# EAGLE design Adafruit Feather M0 Basic rev C (EAGLE 8.4.1)
COMPANY: ADAFRUIT INDUSTRIES; DRAWN: KTOWN; REV: B
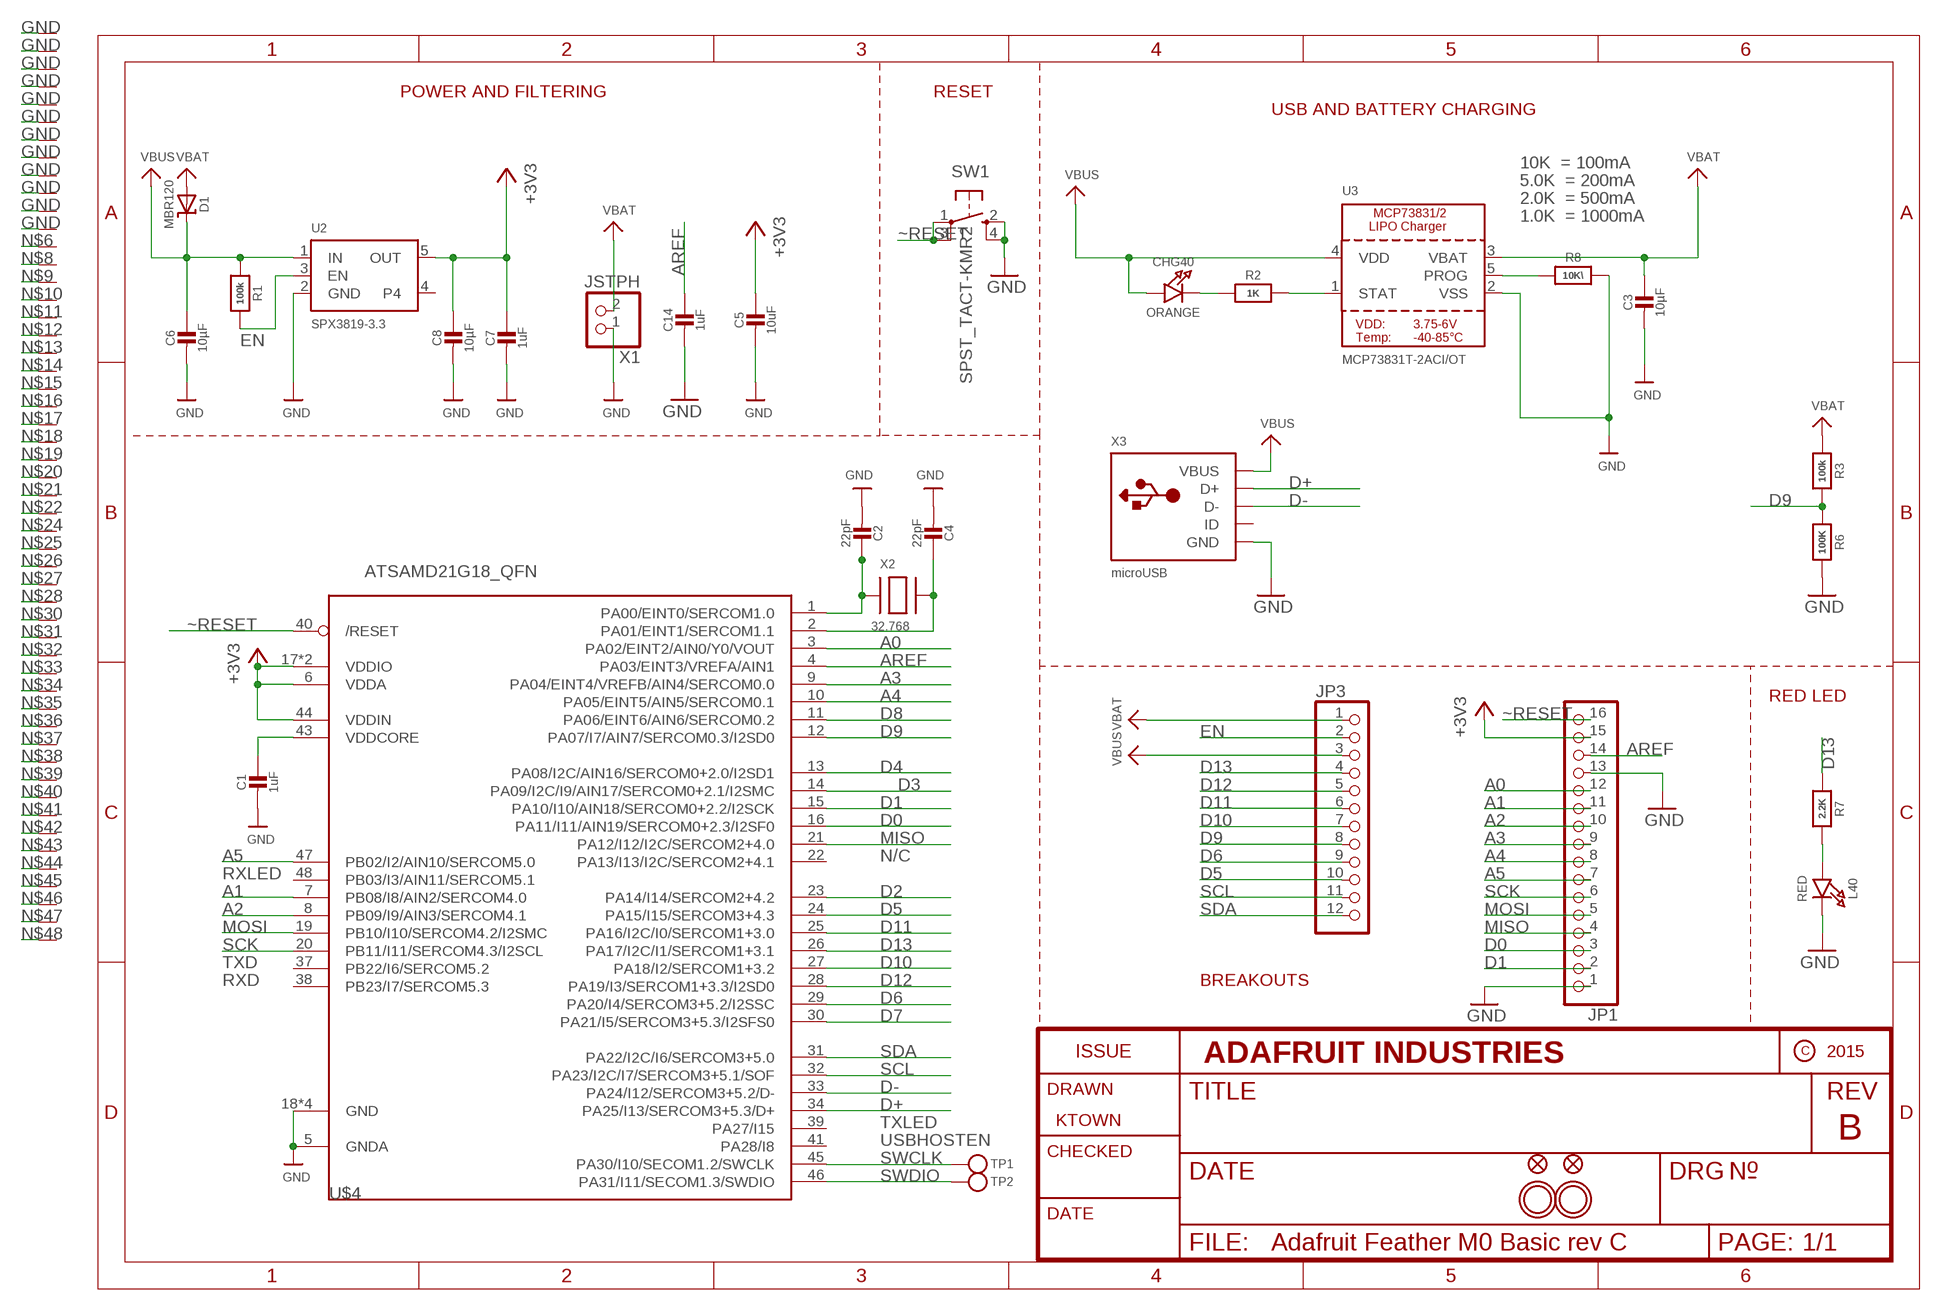
[diagram p0: schematic, sheet 1]

## Parts
C1  1uF  CAP_CERAMIC0603_NO  [0603-NO]
C2  22pF  CAP_CERAMIC0603_NO  [0603-NO]
C3  10µF  CAP_CERAMIC0805-NOOUTLINE  [0805-NO]
C4  22pF  CAP_CERAMIC0603_NO  [0603-NO]
C5  10uF  CAP_CERAMIC0805-NOOUTLINE  [0805-NO]
C6  10µF  CAP_CERAMIC0805-NOOUTLINE  [0805-NO]
C7  1uF  CAP_CERAMIC0603_NO  [0603-NO]
C8  10µF  CAP_CERAMIC0805-NOOUTLINE  [0805-NO]
C14  1uF  CAP_CERAMIC0603_NO  [0603-NO]
CHG40  ORANGE  LED0805_NOOUTLINE  [CHIPLED_0805_NOOUTLINE]
D1  MBR120  DIODE-SCHOTTKYSOD-123  [SOD-123]
JP1  HEADER-1X16ROUND  [1X16_ROUND]
JP3  HEADER-1X12  [1X12_ROUND]
L40  RED  LED0805_NOOUTLINE  [CHIPLED_0805_NOOUTLINE]
R1  100k  RESISTOR_0603_NOOUT  [0603-NO]
R2  1K  RESISTOR_0603_NOOUT  [0603-NO]
R3  100k  RESISTOR_0603_NOOUT  [0603-NO]
R6  100K  RESISTOR_0603_NOOUT  [0603-NO]
R7  2.2K  RESISTOR_0603_NOOUT  [0603-NO]
R8  10K\  RESISTOR_0603_NOOUT  [0603-NO]
SW1  SPST_TACT-KMR2  [KMR2]
TP1  TESTPOINTROUND1.5MM  [TESTPOINT_ROUND_1.5MM]
TP2  TESTPOINTROUND1.5MM  [TESTPOINT_ROUND_1.5MM]
U2  SPX3819-3.3  VREG_SOT23-5  [SOT23-5]
U3  MCP73831T-2ACI/OT  MCP73831/2  [SOT23-5]
U$4  ATSAMD21G18_QFN  ATSAMD21J_QFN  [TQFN48_7MM]
U$31  MOUNTINGHOLE2.5  [MOUNTINGHOLE_2.5_PLATED]
U$32  MOUNTINGHOLE2.5  [MOUNTINGHOLE_2.5_PLATED]
U$34  FIDUCIAL""  [FIDUCIAL_1MM]
U$35  FIDUCIAL""  [FIDUCIAL_1MM]
VP_0  VPDEV0  [VPAC0]
VP_1  VPDEV0  [VPAC0]
VP_2  VPDEV0  [VPAC0]
VP_3  VPDEV0  [VPAC0]
VP_4  VPDEV0  [VPAC0]
VP_5  VPDEV0  [VPAC0]
VP_6  VPDEV0  [VPAC0]
VP_7  VPDEV0  [VPAC0]
VP_8  VPDEV0  [VPAC0]
VP_9  VPDEV0  [VPAC0]
VP_10  VPDEV0  [VPAC0]
VP_11  VPDEV0  [VPAC0]
VP_12  VPDEV1  [VPAC1]
VP_13  VPDEV1  [VPAC1]
VP_14  VPDEV1  [VPAC1]
VP_15  VPDEV1  [VPAC1]
VP_16  VPDEV1  [VPAC1]
VP_17  VPDEV1  [VPAC1]
VP_18  VPDEV1  [VPAC1]
VP_19  VPDEV1  [VPAC1]
VP_20  VPDEV1  [VPAC1]
VP_21  VPDEV1  [VPAC1]
VP_22  VPDEV1  [VPAC1]
VP_23  VPDEV1  [VPAC1]
VP_24  VPDEV1  [VPAC1]
VP_25  VPDEV1  [VPAC1]
VP_26  VPDEV1  [VPAC1]
VP_27  VPDEV1  [VPAC1]
VP_28  VPDEV1  [VPAC1]
VP_29  VPDEV1  [VPAC1]
VP_30  VPDEV1  [VPAC1]
VP_31  VPDEV1  [VPAC1]
VP_32  VPDEV1  [VPAC1]
VP_33  VPDEV1  [VPAC1]
VP_34  VPDEV1  [VPAC1]
VP_35  VPDEV1  [VPAC1]
VP_36  VPDEV1  [VPAC1]
VP_37  VPDEV1  [VPAC1]
VP_38  VPDEV1  [VPAC1]
VP_39  VPDEV1  [VPAC1]
VP_40  VPDEV1  [VPAC1]
VP_41  VPDEV1  [VPAC1]
VP_42  VPDEV1  [VPAC1]
VP_43  VPDEV1  [VPAC1]
VP_44  VPDEV1  [VPAC1]
VP_45  VPDEV1  [VPAC1]
VP_46  VPDEV1  [VPAC1]
VP_47  VPDEV1  [VPAC1]
VP_48  VPDEV1  [VPAC1]
VP_49  VPDEV1  [VPAC1]
VP_50  VPDEV1  [VPAC1]
VP_51  VPDEV1  [VPAC1]
X1  JSTPH  CON_JST_PH_2PIN  [JSTPH2]
X2  32.768  XTAL-3.2X1.5  [XTAL3215]
X3  microUSB  USB_MICRO_20329_V2  [4UCONN_20329_V2]

## Nets
+3V3: C5.1 C7.1 C8.1 JP1.15 U2.5(OUT) U$4.6(VDDA) U$4.17(VDDIO) U$4.36(VDDIO) U$4.44(VDDIN)
A0: JP1.12 U$4.3(PA02/EINT2/AIN0/Y0/VOUT)
A1: JP1.11 U$4.7(PB08/I8/AIN2/SERCOM4.0)
A2: JP1.10 U$4.8(PB09/I9/AIN3/SERCOM4.1)
A3: JP1.9 U$4.9(PA04/EINT4/VREFB/AIN4/SERCOM0.0)
A4: JP1.8 U$4.10(PA05/EINT5/AIN5/SERCOM0.1)
A5: JP1.7 U$4.47(PB02/I2/AIN10/SERCOM5.0)
AREF: C14.1 JP1.14 U$4.4(PA03/EINT3/VREFA/AIN1)
D0: JP1.3 U$4.16(PA11/I11/AIN19/SERCOM0+2.3/I2SF0)
D1: JP1.2 U$4.15(PA10/I10/AIN18/SERCOM0+2.2/I2SCK)
D2: U$4.23(PA14/I14/SERCOM2+4.2)
D3: U$4.14(PA09/I2C/I9/AIN17/SERCOM0+2.1/I2SMC)
D4: U$4.13(PA08/I2C/AIN16/SERCOM0+2.0/I2SD1)
D5: JP3.10 U$4.24(PA15/I15/SERCOM3+4.3)
D6: JP3.9 U$4.29(PA20/I4/SERCOM3+5.2/I2SSC)
D7: U$4.30(PA21/I5/SERCOM3+5.3/I2SFS0)
D8: U$4.11(PA06/EINT6/AIN6/SERCOM0.2)
D9: JP3.8 R3.2 R6.1 U$4.12(PA07/I7/AIN7/SERCOM0.3/I2SD0)
D10: JP3.7 U$4.27(PA18/I2/SERCOM1+3.2)
D11: JP3.6 U$4.25(PA16/I2C/I0/SERCOM1+3.0)
D12: JP3.5 U$4.28(PA19/I3/SERCOM1+3.3/I2SD0)
D13: JP3.4 R7.1 U$4.26(PA17/I2C/I1/SERCOM1+3.1)
D+: U$4.34(PA25/I13/SERCOM3+5.3/D+) X3.D+
D-: U$4.33(PA24/I12/SERCOM3+5.2/D-) X3.D-
EN: JP3.2 R1.2 U2.3(EN)
GND: C1.2 C2.2 C3.2 C4.2 C5.2 C6.2 C7.2 C8.2 C14.2 JP1.1 JP1.13 L40.C R6.2 R8.2 SW1.2(S) SW1.4(S1) U2.2(GND) U3.2(VSS) U$4.5(GNDA) U$4.18(GND) U$4.35(GND) U$4.42(GND) U$4.THERMAL(GND) VP_0.VP VP_1.VP VP_2.VP VP_3.VP VP_4.VP VP_5.VP VP_6.VP VP_7.VP VP_8.VP VP_9.VP VP_10.VP VP_11.VP X1.1 X3.BASE@1(GND) X3.BASE@2(GND) X3.GND X3.SPRT@1(GND) X3.SPRT@2(GND) X3.SPRT@3(GND) X3.SPRT@4(GND)
MISO: JP1.4 U$4.21(PA12/I12/I2C/SERCOM2+4.0)
MOSI: JP1.5 U$4.19(PB10/I10/SERCOM4.2/I2SMC)
N$1: CHG40.C R2.1
N$2: L40.A R7.2
N$3: R2.2 U3.1(STAT)
N$4: R8.1 U3.5(PROG)
N$5: C2.1 U$4.1(PA00/EINT0/SERCOM1.0) X2.P$1
N$6: VP_12.VP
N$7: C4.1 U$4.2(PA01/EINT1/SERCOM1.1) X2.P$2
N$8: VP_13.VP
N$9: VP_14.VP
N$10: VP_15.VP
N$11: VP_16.VP
N$12: VP_17.VP
N$13: VP_18.VP
N$14: VP_19.VP
N$15: VP_20.VP
N$16: VP_21.VP
N$17: VP_22.VP
N$18: VP_23.VP
N$19: VP_24.VP
N$20: VP_25.VP
N$21: VP_26.VP
N$22: VP_27.VP
N$24: VP_28.VP
N$25: VP_29.VP
N$26: VP_30.VP
N$27: VP_31.VP
N$28: VP_32.VP
N$30: VP_33.VP
N$31: VP_34.VP
N$32: VP_35.VP
N$33: VP_36.VP
N$34: VP_37.VP
N$35: VP_38.VP
N$36: VP_39.VP
N$37: VP_40.VP
N$38: VP_41.VP
N$39: VP_42.VP
N$40: VP_43.VP
N$41: VP_44.VP
N$42: VP_45.VP
N$43: VP_46.VP
N$44: VP_47.VP
N$45: VP_48.VP
N$46: VP_49.VP
N$47: VP_50.VP
N$48: VP_51.VP
SCK: JP1.6 U$4.20(PB11/I11/SERCOM4.3/I2SCL)
SCL: JP3.11 U$4.32(PA23/I2C/I7/SERCOM3+5.1/SOF)
SDA: JP3.12 U$4.31(PA22/I2C/I6/SERCOM3+5.0)
SWCLK: TP1.P$1 U$4.45(PA30/I10/SECOM1.2/SWCLK)
SWDIO: TP2.P$1 U$4.46(PA31/I11/SECOM1.3/SWDIO)
VBAT: C3.1 D1.A JP3.1 R3.1 U3.3(VBAT) X1.2
VBUS: C6.1 CHG40.A D1.C JP3.3 R1.1 U2.1(IN) U3.4(VDD) X3.VBUS
VDDCORE: C1.1 U$4.43(VDDCORE)
~RESET: JP1.16 SW1.1(P) SW1.3(P1) U$4.40(/RESET)
Unconnected: U2.4 U$4.22(PA13/I13/I2C/SERCOM2+4.1) U$4.37(PB22/I6/SERCOM5.2) U$4.38(PB23/I7/SERCOM5.3) U$4.39(PA27/I15) U$4.41(PA28/I8) U$4.48(PB03/I3/AIN11/SERCOM5.1) X3.ID

## Notes on the sheet
- POWER AND FILTERING | RESET
- USB AND BATTERY CHARGING
- 10K  = 100mA
- 5.0K  = 200mA
- 2.0K  = 500mA
- 1.0K  = 1000mA
- RED LED
- N/C
- RXLED
- TXD
- RXD | BREAKOUTS
- TXLED
- USBHOSTEN

## Library data of the parts
C1-C8 C14 = microbuilder:CAP_CERAMIC: Ceramic Capacitors For new designs, use the packages preceded by an '_' character since they are more reliable: The following footprints should be used on most boards: _0402 - Standard footprint for regular board layouts _0603 - Standard footprint for regular board layouts _0805 - Standard footprint for regular board layouts _1206 - Standard footprint for regular board layouts For extremely tight-pitch boards where space is at a premium, the following 'micro-pitch' footprints can be used (smaller pads, no silkscreen outline, etc.): _0402MP - Micro-pitch footprint for very dense/compact boards _0603MP - Micro-pitch footprint for very dense/compact boards _0805MP - Micro-pitch footprint for very dense/compact boards _1206MP - Micro-pitch footprint for very dense/compact boards
CHG40 L40 = microbuilder:LED: LED 0603 - 0603 Surface Mount Package 2mA: Green LED - Low Power (3.9mcd, 2ma, 1.7Vf) - Digikey: 475-2709-2-ND Orange LED - Low Power (9.8mcd, 2ma, 1.8Vf) - Digikey: 475-1194-2-ND Red LED - Low Power (5mcd, 2ma, 1.8Vf) - Digikey: 475-1195-2-ND Yellow LED - Low Power (7mcd, 2ma, 1.8Vf) - Digikey: 475-1196-2-ND 5mA: Blue LED - Low Power (17mcd, 5ma, 2.9Vf) - Digikey: LNJ937W8CRACT-ND 0805 - 0805 Surface Mount Package 2mA: Red LED (8.8mcd, 2mA, 1.8Vf, Clear) - Low Power [Digikey: 475-2510-1-ND] Green LED (5mcd, 2mA, 1.8Vf, Clear) - Low Power [Digikey: 475-2730-1-ND] Yellow LED (11.3mcd, 2mA, 1.8Vf, Clear) - Low Power [Digikey: 475-2555-1-ND] 20mA: Red LED (104mcd, 20mA, Diffused) - LS R976 [Digikey: 475-1278-6-ND] Red LED (12mcd, 20mA, 2.0Vf, Clear) - APT2012EC [Digikey: 754-1128-1-ND] Green LED (15mcd, 20mA, 2.2Vf, Clear) - APT2012GC [Digikey: 754-1131-1-ND] Orange LED (160mcd, 20mA, 2.1Vf, Clear) - APT2012SECK [Digikey: 754-1130-1-ND] 1206 - 1206 Surface Mount Package Green LED (26mcd, 20mA, Diffused) - LG N971 [Digikey: 475-1407-6-ND] Red LED (15mcd, 20mA, Diffused) - LH N974 [Digikey: 475-1416-6-ND] Cree - Cree High-Power Surface Mount LEDs XPEBWT-L1-0000-00D50 - White 111lm 350mA 2.9Vf 6200K 110° XTEAWT-00-0000-00000LEE3 - White 114lm 350mA 2.85Vf 5000K 115° Everlight - Everlight 45-21 Series Surface Mount LEDs 45-21/QK2C-B2832AC2CB2/2T - Warm White 2000mcd 20mA 3.25Vf 3050K 120° 45-21/LK2C-B38452C4CB2/2T - Nuetral White 2000mcd 20mA 3.25Vf 4150K 120° 45-21/LK2C-B50634C6CB2/2T - Cold White 2200mcd 20mA 3.25Vf 5650K 120° PLCC2 Reverse Mount LS T77K-J1L2-1-0-2-R18-Z - Red 11.25mcd 2mA 1.8Vf 630nm 120° LO T77K-L1M2-24-Z - Orange 19.6mcd 2mA 1.8Vf 606nm 120° LY T77K-K2M1-26-Z - Yellow 15.7mcd 2mA 1.8Vf 587nm 120°
D1 = microbuilder:DIODE-SCHOTTKY
JP1 = microbuilder:HEADER-1X16: PIN HEADER
JP3 = microbuilder:HEADER-1X12
R1-R3 R6-R8 = microbuilder:RESISTOR: Resistors For new designs, use the packages preceded by an '_' character since they are more reliable: The following footprints should be used on most boards: _0402 - Standard footprint for regular board layouts _0603 - Standard footprint for regular board layouts _0805 - Standard footprint for regular board layouts _1206 - Standard footprint for regular board layouts For extremely tight-pitch boards where space is at a premium, the following 'micro-pitch' footprints can be used (smaller pads, no silkscreen outline, etc.): _0402MP - Micro-pitch footprint for very dense/compact boards _0603MP - Micro-pitch footprint for very dense/compact boards _0805MP - Micro-pitch footprint for very dense/compact boards _1206MP - Micro-pitch footprint for very dense/compact boards
SW1 = adafruit:SPST_TACT: SMT 6mm switch, EVQQ2 series http://www.ladyada.net/library/eagle
TP1 TP2 = microbuilder:TESTPOINT: Test Point Various test points for characterisation and PCB testing TESTPOINT_SMT - Compact Surface Mount Test Point [Digikey: 5016KTR-ND]
U2 = microbuilder:VREG_SOT23-5: SOT23-5 Fixed Voltage Regulators Part Current Out V Out V In V Dropout θJA (°C/W) TJ (°C) Digikey Part No. ADP121 150mA 3.3V 3.4-5.5V 0.09V @ 150mA -- -- ADP121-AUJZ33R7CT-ND ADP121 150mA 3.0V 3.1-5.5V 0.09V @ 150mA -- -- ADP121-AUJZ30R7CT-ND ADP122 300mA 3.3V 3.4-5.5V 0.085V @ 300mA -- -- ADP122AUJZ-3.3-R7CT-ND ADP1712 300mA 3.3V 3.5-5.5V 0.17V @ 300mA -- -- ADP1712AUJZ-3.3-R7TR-ND AP7311 (Low Cost) 150mA 3.3V 3.5-6V 0.15V @ 150mA -- -- AP7311-33WG-7DICT-ND LD39015M18R 150mA 1.8V 1.9V-5.5V 0.08V @ 100mA -- -- 497-6977-1-ND LP2985A-33DBVR 150mA 3.3V 3.3-16V 0.28V @ 150mA 206 150 296-18479-1-ND MCP1824T-3302E/OT 300mA 3.3V 3.5V-6V 0.2V @ 300mA -- -- MCP1824T-3302E/OTCT-ND MIC5205-2.5YM5 TR 150mA 2.5V 2.7-16V 0.165V @ 150mA -- -- 576-1257-2-ND MIC5205-3.0YM5 TR 150mA 3.0V 3.2V-16V 0.165V @ 150mA -- -- 576-1258-2-ND MIC5205-3.3YM5 TR 150mA 3.3V 3.5V-16V 0.165V @ 150mA -- -- 576-1259-2-ND TPS780330220 150mA 3.3V+2.2V 3.6-5.5V 250mV Max -- -- 296-23332-1-ND TDA3663/N1,135 100mA 3.3V 3.5-45V 0.18V @ 50mA -- -- 568-5343-1-ND Max operating temp can be calculated using θJA, TJ (max junction temperature), and power in watts. Set the "Maximum Ambient Temperature" until it reaches TJ ("Max Junction Temperature"), which is the absolute limit for safe use of the regulator: Heat Sink Temperature Calculator <http://www.daycounter.com/Calculators/Heat-Sink-Temperature-Calculator.phtml> For example, With 12V source into a 3.3V LP2985 and a 30mA load, we are dissipating (12V-3.3V) * 0.03A = 0.261W. With a θJA of 206 °C/W, a TJ of 150°C, and 261mW we can safely use the chip without a heat sink up to 75°C (=147.1°C Junction Temperature).
U3 = microbuilder:MCP73831/2: MCP73831/2 LIPO Charger VDD: 3.75 - 6V Temp -40 - 85°C Programmable Charge Rate: 15-500mA NOTE: STAT is a tri-state logic output on the MCP73831 and an open-drain output on the MCP73832. SOT23-5 with 4.2V output and tri-state logic on STAT = MCP73831T-2ACI/OT
U$4 = microbuilder:ATSAMD21J
U$31 U$32 = microbuilder:MOUNTINGHOLE: Mounting Hole For #2 screws (0.086"/2.18mm width, 0.094"/2.4mm hole) use 2.5mm; BOM: EXCLUDE
U$34 U$35 = microbuilder:FIDUCIAL: Fiducial Alignment Points Various fiducial points for machine vision alignment.; BOM: EXCLUDE
VP_0 VP_1-VP_11 = vpad:VPDEV0: VIAPAD
VP_12-VP_51 = vpad:VPDEV1: VIAPAD
X1 = microbuilder:CON_JST_PH_2PIN: JST 2-Pin Right-Angle Connector PH-Series - 4UConnector: 17311 SH-Series - 4UConnector: 07278
X2 = adafruit2:XTAL: Low cost SMT crystals, no capacitors included http://www.ladyada.net/library/eagle
X3 = microbuilder:USB: USB Connectors USBMINIB - Surface Mount Female Mini-B USB Connector 4UConnector: 06564

## Board
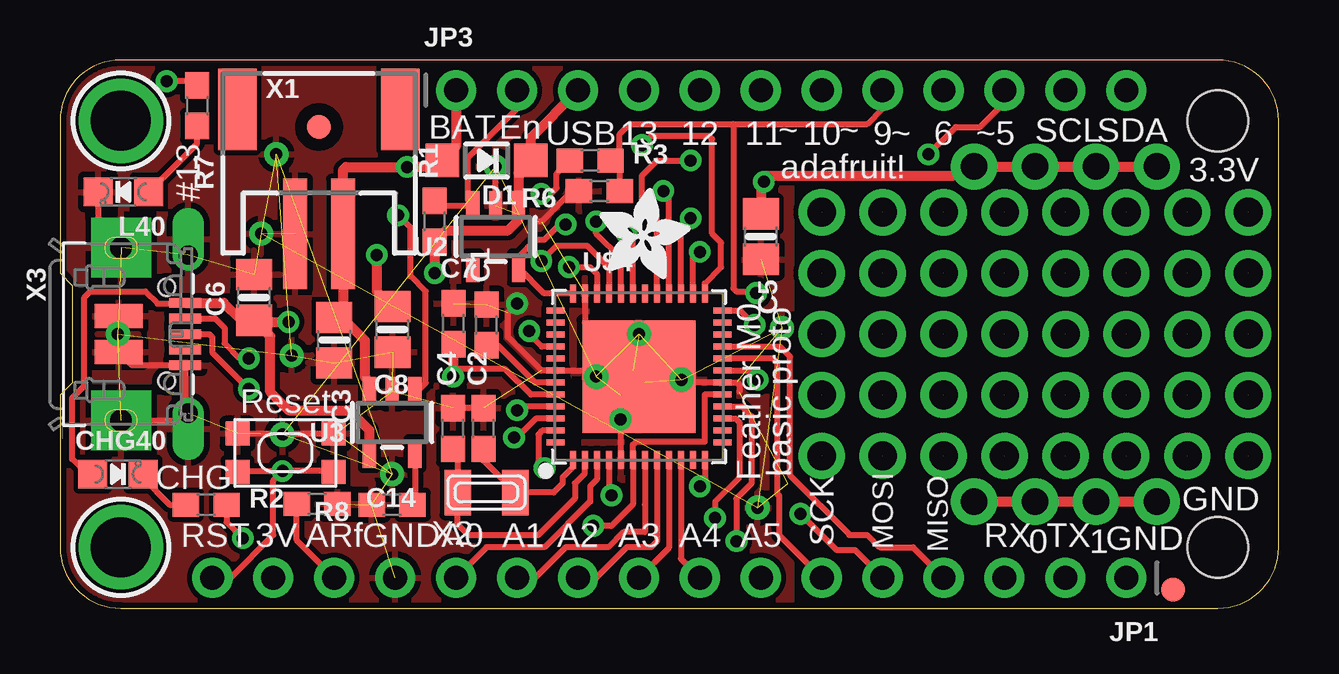
[diagram p1: board, top side]
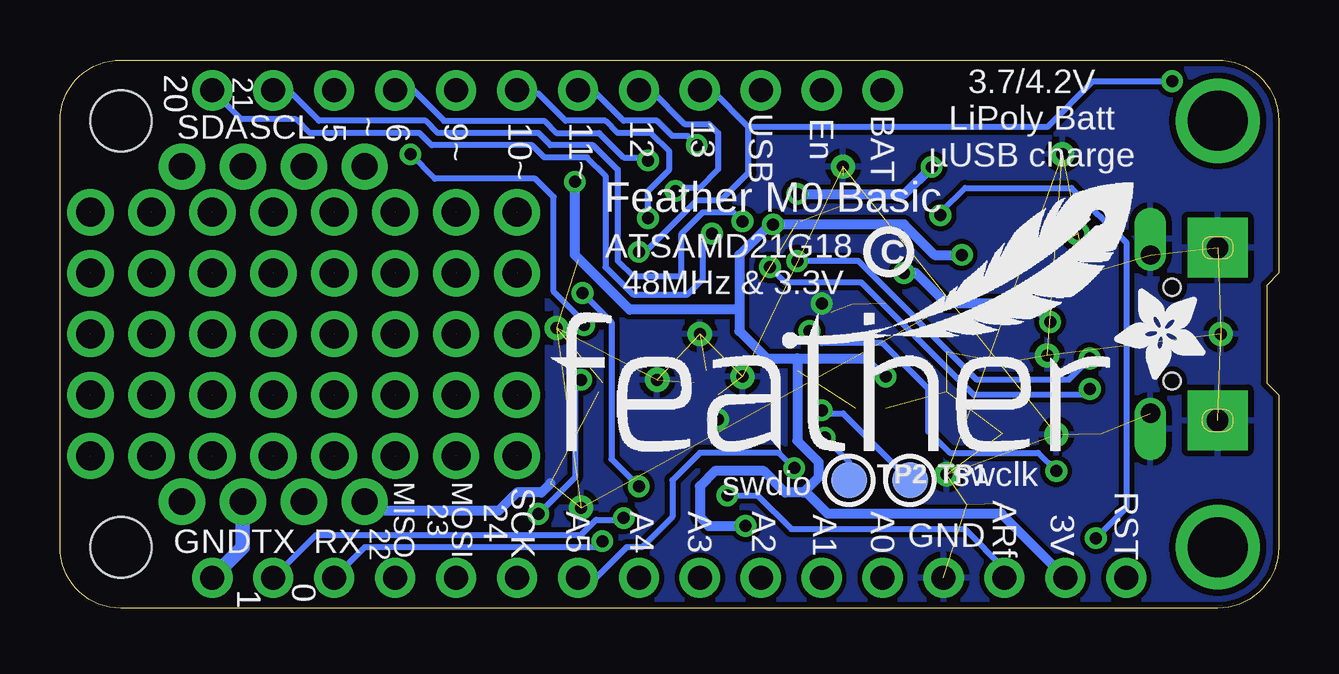
[diagram p2: board, bottom side, seen from below]

Size 50.8 x 22.86 mm. Coordinates in mm from the lower left corner, seen from the top.
Outline: 2.54,0 48.26,0 arc90 50.8,2.54 50.8,20.32 arc90 48.26,22.86 2.54,22.86 arc90 0,20.32 0,13.97 0.51,13.46 0.51,9.4 0,8.89 0,2.54 arc90 2.54,0
Copper layers (1*16): Top 0.035mm / dielectric 1.5mm / Bottom 0.035mm
Design rules "adafruit *": minimum track width 8mil, minimum drill 15.5mil, track to track 8mil, track to pad 8mil, pad to pad 8mil, via to via 8mil, smd to smd 8mil, copper to edge 10mil, drill to drill 8mil, minimum pad ring 10mil, minimum via ring 8mil, stop-mask expansion 2mil, vias tented up to drill 20mil, thermal gap 10mil
Holes 2.54 mm at 48.26,20.32 48.26,2.54
tRestrict: area 21.3,6.9 to 21.7,9.7; area 22.1,12.1 to 27.1,12.4; area 26.5,9.7 to 27.1,12.2

### Footprints (pad centres in the part's own frame; a part is rotated, then mirrored left to right if it is on the bottom)
0603-NO = smd 1.1 x 1: 1 -0.85,0; 2 0.85,0
0805-NO = smd 1.3 x 1.5: 1 -0.95,0; 2 0.95,0
CHIPLED_0805_NOOUTLINE = smd 1.2 x 1.2: A 0,-1.05; C 0,1.05
SOD-123 = smd 1.4 x 1.4: A 1.85,0; C -1.85,0
1X16_ROUND = drill 1 pad 1.676: 1 -19.05,0; 2 -16.51,0; 3 -13.97,0; 4 -11.43,0; 5 -8.89,0; 6 -6.35,0; 7 -3.81,0; 8 -1.27,0; 9 1.27,0; 10 3.81,0; 11 6.35,0; 12 8.89,0; 13 11.43,0; 14 13.97,0; 15 16.51,0; 16 19.05,0
1X12_ROUND = drill 1 pad 1.676: 1 -13.97,0; 2 -11.43,0; 3 -8.89,0; 4 -6.35,0; 5 -3.81,0; 6 -1.27,0; 7 1.27,0; 8 3.81,0; 9 6.35,0; 10 8.89,0; 11 11.43,0; 12 13.97,0
KMR2 = smd 1 x 1: 1 2,0.8; 2 2,-0.8; 3 -2,0.8; 4 -2,-0.8
TESTPOINT_ROUND_1.5MM = smd 1.5 x 1.5: P$1 0,0
SOT23-5 = smd 0.55 x 1.2: 1 -0.95,-1.3; 2 0,-1.3; 3 0.95,-1.3; 4 0.95,1.3; 5 -0.95,1.3
TQFN48_7MM = smd 0.25 x 0.75: 1 -2.75,-3.475; 2 -2.25,-3.475; 3 -1.75,-3.475; 4 -1.25,-3.475; 5 -0.75,-3.475; 6 -0.25,-3.475; 7 0.25,-3.475; 8 0.75,-3.475; 9 1.25,-3.475; 10 1.75,-3.475; 11 2.25,-3.475; 12 2.75,-3.475; 25 2.75,3.475; 26 2.25,3.475; 27 1.75,3.475; 28 1.25,3.475; 29 0.75,3.475; 30 0.25,3.475; 31 -0.25,3.475; 32 -0.75,3.475; 33 -1.25,3.475; 34 -1.75,3.475; 35 -2.25,3.475; 36 -2.75,3.475 | smd 0.75 x 0.25: 13 3.475,-2.75; 14 3.475,-2.25; 15 3.475,-1.75; 16 3.475,-1.25; 17 3.475,-0.75; 18 3.475,-0.25; 19 3.475,0.25; 20 3.475,0.75; 21 3.475,1.25; 22 3.475,1.75; 23 3.475,2.25; 24 3.475,2.75; 37 -3.475,2.75; 38 -3.475,2.25; 39 -3.475,1.75; 40 -3.475,1.25; 41 -3.475,0.75; 42 -3.475,0.25; 43 -3.475,-0.25; 44 -3.475,-0.75; 45 -3.475,-1.25; 46 -3.475,-1.75; 47 -3.475,-2.25; 48 -3.475,-2.75 | smd 4.7 x 4.7: THERMAL 0,0
MOUNTINGHOLE_2.5_PLATED = drill 2.5 pad 3.2: P$1 0,0
FIDUCIAL_1MM = smd 1 x 1: 1 0,0
VPAC0 = drill 0.5 pad 0.906: VP 0,0
VPAC1 = drill 1.2 pad 1.93: VP 0,0
JSTPH2 = smd 1 x 4.6: 1 -1,-3.7; 2 1,-3.7 | smd 1.6 x 3.4: NC1 -3.4,1.5; NC2 3.4,1.5
XTAL3215 = smd 1.1 x 1.9: P$1 1.2,0; P$2 -1.2,0
4UCONN_20329_V2 = smd 1 x 2: BASE@1 -0.75,-2; BASE@2 0.75,-2 | smd 0.4 x 1.35: D+ 0,0.775; D- -0.65,0.775; GND 1.3,0.775; ID 0.65,0.775; VBUS -1.3,0.775 | drill 0.8 pad 1.2 offset: SPRT@1 -3.3,0.9; SPRT@2 3.3,0.9 | drill 0.9 pad 2.5 square: SPRT@3 -3.6,-1.9; SPRT@4 3.6,-1.9 | hole 0.7: -1.95,0; 1.95,0

### Placement (x,y rotation side)
C1  17.78,11.81 90 top
C2  17.65,7.49 90 top
C3  11.43,11.18 270 top
C4  16.38,7.49 90 top
C5  29.21,15.49 270 top
C6  8.09,12.96 90 top
C7  16.4,11.86 90 top
C8  13.86,11.62 270 top
C14  10.72,4.34 0 top
CHG40  2.41,5.59 270 top
D1  17.78,18.67 180 top
JP1  25.4,1.27 180 top
JP3  30.48,21.59 0 top
L40  2.65,17.36 90 top
R1  15.62,16.13 90 top
R2  6.1,4.32 0 top
R3  22.1,18.67 0 top
R6  22.48,17.4 180 top
R7  5.71,20.95 270 top
R8  13.84,4.32 180 top
SW1  9.4,6.48 180 top
TP1  15.37,5.33 0 bottom
TP2  17.91,5.33 0 bottom
U2  18.16,15.49 180 top
U3  13.84,7.75 180 top
U$4  24.13,9.65 0 top
U$7  [ADAFRUIT_3.5MM]  22.48,13.72 0 top
U$9  [FEATHERLOGO]  30.35,6.48 0 bottom
U$12  [ADAFRUIT_3.5MM]  3.05,13.34 180 bottom
U$13  [PCBFEAT-REV-040]  16.26,14.86 0 bottom
U$31  2.54,20.32 270 top
U$32  2.54,2.54 270 top
U$34  10.79,20.07 270 top
U$35  46.4,0.77 270 top
VP_0  2.41,11.43 0 top
VP_1  9.65,10.54 0 top
VP_2  9.02,18.92 0 top
VP_3  13.84,5.59 0 top
VP_4  9.27,7.24 0 top
VP_5  18.16,18.41 0 top
VP_6  22.35,9.65 0 top
VP_7  24.13,11.43 0 top
VP_8  25.91,9.53 0 top
VP_9  30.1,11.68 0 top
VP_10  29.08,4.19 0 top
VP_11  8.38,15.62 0 top
VP_12  31.75,8.89 0 top
VP_13  44.45,16.51 0 top
VP_14  44.45,13.97 0 top
VP_15  46.99,13.97 0 top
VP_16  46.99,16.51 0 top
VP_17  49.53,16.51 0 top
VP_18  49.53,13.97 0 top
VP_19  49.53,11.43 0 top
VP_20  49.53,8.89 0 top
VP_21  46.99,8.89 0 top
VP_22  46.99,11.43 0 top
VP_23  44.45,11.43 0 top
VP_24  44.45,8.89 0 top
VP_25  44.45,6.35 0 top
VP_26  46.99,6.35 0 top
VP_27  31.75,6.35 0 top
VP_28  41.91,6.35 0 top
VP_29  41.91,8.89 0 top
VP_30  41.91,11.43 0 top
VP_31  41.91,13.97 0 top
VP_32  41.91,16.51 0 top
VP_33  39.37,16.51 0 top
VP_34  39.37,13.97 0 top
VP_35  39.37,11.43 0 top
VP_36  39.37,8.89 0 top
VP_37  39.37,6.35 0 top
VP_38  36.83,6.35 0 top
VP_39  36.83,8.89 0 top
VP_40  36.83,11.43 0 top
VP_41  36.83,13.97 0 top
VP_42  36.83,16.51 0 top
VP_43  34.29,16.51 0 top
VP_44  34.29,13.97 0 top
VP_45  34.29,11.43 0 top
VP_46  34.29,8.89 0 top
VP_47  34.29,6.35 0 top
VP_48  49.53,6.35 0 top
VP_49  31.75,13.97 0 top
VP_50  31.75,11.43 0 top
VP_51  31.75,16.51 0 top
X1  10.79,19.3 0 top
X2  17.78,4.83 0 top
X3  4.45,11.43 270 top

### Tracks (layer width: path | path; a pad name or v marks a point on that pad's centre or on a via)
+3V3  (via drill 0.5, 1.1 pad 1.93)
  Top 0.254: U$4.44 19.63,8.9 18.56,9.97 16.57,9.97 16.4,10.14 C7.1 16.4,10.04 | v22.23,3.43 22.99,3.43 23.88,4.32 U$4.6 23.88,6.81 24,6.93 26.87,6.93 26.87,8.9 U$4.17 | U$4.36 20.18,13.13 U2.5 19.11,14.67 19.81,15.37 20.19,15.37 20.83,16 v21.08,16
  Top 0.406: v38.1,18.41 37.85,18.16 | v38.1,18.41 v40.64,18.41 v43.18,18.41 v45.72,18.41 | C5.1 29.21,17.65 v29.34,17.78 29.34,18.03 37.21,18.03 37.59,18.41 v38.1,18.41 | v13.21,14.73 13.21,13.22 C8.1 | v16.38,9.65 16.38,10.99 C7.1
  Bottom 0.254: 21.21,16 v21.08,16
  Bottom 0.406: v22.23,3.43 23.75,3.43 24.13,3.81 24.13,5.08 23.5,5.71 21.46,5.71 20.57,4.83 19.81,4.83 19.68,4.95 | 21.21,16 22.48,14.73 22.48,12.57 | 22.48,12.57 22.48,11.56 21.34,10.41 20.07,10.41 | 20.07,10.41 17.27,10.41 16.38,9.53 v16.38,9.65 | v13.21,14.73 14.35,14.73 15.62,16 v21.08,16 | 22.48,12.57 22.61,12.45 27.05,12.45 29.34,14.73 v29.34,17.78 | 20.07,10.41 20.07,6.99 19.18,6.1 19.18,5.46 19.68,4.95 | JP1.15 11.56,3.94 18.8,3.94 19.68,4.83 19.68,4.95
A0
  Top 0.254: U$4.3 22.38,5.36 22.1,5.08 22.1,4.45 20.19,2.54 17.78,2.54 JP1.12
A1
  Top 0.254: U$4.7 24.38,4.31 24.38,3.17 23.5,3.17 22.86,2.54 21.08,2.54 19.81,1.27 JP1.11
A2
  Top 0.254: U$4.8 24.88,2.78 24.64,2.54 23.62,2.54 22.35,1.27 JP1.10 21.84,1.27
A3
  Top 0.254: U$4.9 25.38,2.52 JP1.9
A4
  Top 0.254: U$4.10 25.88,2.06 JP1.8
A5  (via drill 0.5)
  Top 0.254: U$4.47 20.1,7.4 19.94,7.24 19.94,6.1 v20.19,5.84
  Bottom 0.254: v20.19,5.84 20.83,6.48 24.13,6.48 25.27,5.33 25.27,3.81 26.54,2.54 27.18,2.54 28.45,1.27 JP1.7
AREF  (via drill 0.5)
  Top 0.254: JP1.14 9.87,2.83 C14.1 | U$4.4 22.88,4.81 v22.99,4.7
  Bottom 0.254: 11.43,1.78 JP1.14 11.43,1.65 13.08,3.3 20.32,3.3 21.72,4.7 v22.99,4.7
D0  (via drill 0.5)
  Top 0.254: U$4.16 28.43,8.4 28.83,8 28.83,5.21 28.19,4.57 v28.19,2.79
  Bottom 0.254: v28.19,2.79 28.45,2.54 38.1,2.54 JP1.3
D1  (via drill 0.5)
  Top 0.254: U$4.15 28.17,7.9 28.32,7.75 28.32,5.46 27.3,4.45 v27.3,3.76
  Bottom 0.254: JP1.2 40.13,3.05 29.08,3.05 28.45,3.68 27.3,3.68 v27.3,3.76
D5  (via drill 0.5)
  Top 0.254: U$4.24 28.36,12.4 v28.96,11.81 | v36.2,18.92 37.34,20.07 38.35,20.07 39.37,21.08 JP3.10
  Bottom 0.254: v28.96,11.81 28.83,11.81 30.23,13.21 30.23,17.14 30.99,17.91 35.18,17.91 v36.2,18.92
D6  (via drill 0.5)
  Top 0.254: U$4.29 24.88,16.39 24.26,17.02 24.26,18.03 24.89,18.67 v26.29,18.67
  Bottom 0.254: JP3.9 36.07,21.59 34.8,20.32 30.61,20.32 30.1,19.81 28.32,19.81 27.3,18.8 26.42,18.8 v26.29,18.67
D9  (via drill 0.5)
  Top 0.254: U$4.12 26.88,5.29 v26.67,5.08 | JP3.8 34.29,20.83 33.66,20.19 28.07,20.19 | 28.07,20.19 28.07,13.34 28.19,13.21 28.96,13.21 v29.02,13.14 | R3.2 23.33,18.67 | 23.33,18.67 R6.1 | 23.33,18.67 23.33,19.77 23.75,20.19 28.07,20.19
  Bottom 0.254: v26.67,5.08 27.81,6.22 27.81,11.94 v29.02,13.14
D10  (via drill 0.5)
  Top 0.254: U$4.27 25.88,15.85 v26.29,16.26
  Bottom 0.254: v26.29,16.26 26.29,17.4 25.4,18.29 25.4,19.05 26.16,19.81 27.56,19.81 28.07,20.32 29.72,20.32 30.86,21.46 31.62,21.46 JP3.7
D11  (via drill 0.5)
  Top 0.254: U$4.25 26.88,13.54 27.56,14.22 27.56,15.24 27.18,15.62 27.18,19.56 27.05,19.68 24.64,19.68 v24.26,19.3
  Bottom 0.254: v24.26,19.3 24.64,19.68 25.27,19.68 25.91,20.32 27.3,20.32 28.57,21.59 JP3.6
D12  (via drill 0.5)
  Top 0.254: U$4.28 25.38,17.16 v25.15,17.4
  Bottom 0.254: JP3.5 26.16,21.59 24.77,20.19 23.75,20.19 23.37,19.81 23.37,18.29 24.13,17.53 25.02,17.53 v25.15,17.4
D13  (via drill 0.5)
  Top 0.254: U$4.26 26.38,14.57 v26.67,14.86 | R7.1 5.55,21.97 v4.45,21.97
  Bottom 0.254: 22.1,20.07 9.65,20.07 7.75,21.97 v4.45,21.97 | v26.67,14.86 26.42,14.86 24.26,17.02 23.24,17.02 22.1,18.16 22.1,20.07 | 22.1,20.07 23.62,21.59 JP3.4
D+  (via drill 0.5)
  Top 0.254: X3.D+ 6.22,11.43 6.35,11.3 6.35,10.67 v7.87,9.14 | v21.21,14.22 22.1,14.22 22.38,13.94 U$4.34
  Bottom 0.254: v7.87,9.14 8.13,8.89 12.7,8.89 17.4,13.59 20.57,13.59 v21.21,14.22
D-  (via drill 0.5)
  Top 0.254: X3.D- 6.46,12.08 6.86,11.68 6.86,11.05 7.49,10.41 v7.87,10.41 | v20.07,14.48 20.7,15.11 21.97,15.11 22.88,14.2 U$4.33
  Bottom 0.254: v7.87,10.41 8.76,9.53 12.57,9.53 17.53,14.48 v20.07,14.48
EN
  Top 0.254: JP3.2 19.05,20.83 17.02,18.8 17.02,16.99 U2.3 15.81,16.79 R1.2
GND  (via drill 0.5, 1.1 pad 1.93)  (56 unrouted)
  Top 0.254: L40.C 1.59,15.03 X3.SPRT@3 | X3.BASE@2 3,10.13 X3.GND 5.22,8.26 X3.SPRT@2 5.04,7.83 X3.SPRT@4 | SW1.2 SW1.4 11.52,7.28 | 13.97,10.67 C8.2 | U$4.35 21.88,11.9 U$4.THERMAL | U$4.THERMAL 23.88,9.9 U$4.42 20.07,9.9 18.67,11.3 18.67,12.32 v19.05,12.7 | U$4.5 23.38,8.9 | 23.38,8.9 U$4.THERMAL | U$4.THERMAL 24.38,9.4 U$4.18 28.19,9.4 | C2.2 C4.2 | 28.19,9.4 | U2.2 18.16,18.03 | R6.2 21.34,17.4 20.07,16.13 19.94,16.13 | 23.38,8.9 23.37,8.89 v23.37,7.87 | 28.19,9.4 arc-90 28.32,9.27 28.32,9.02
  Top 0.406: v38.1,4.45 v40.64,4.45 v43.18,4.45 v45.72,4.45
  Bottom 0.406: 30.35,5.21 30.73,4.83 31.75,4.83 32.51,4.06 37.72,4.06 v38.1,4.45
  Bottom 0.61: JP1.1 43.18,2.54 v43.18,4.45
  pour Top: 0,22.86 0,0 30.48,0 30.48,22.86
  pour Bottom: 30.48,0 0,0 0,22.86 30.48,22.86
MISO
  Top 0.254: JP1.4 35.56,2.54 34.16,2.54 33.66,3.05 33.15,3.05 32.92,3.05 | 32.89,3.05 32.92,3.05 | U$4.21 30.02,10.9 30.43,10.49 30.43,5.54 32.92,3.05
MOSI  (via drill 0.5)
  Top 0.254: U$4.19 28.71,9.9 v29.08,9.53 | JP1.5 33.15,2.41 32.38,2.41 v30.86,3.94
  Bottom 0.254: v29.08,9.53 29.34,9.27 29.34,5.46 v30.86,3.94
N$1
  Top 0.254: CHG40.C 3.46,5.43 4.57,4.32 R2.1
N$2
  Top 0.254: L40.A 5.71,19.38 R7.2
N$3  (via drill 0.5)
  Top 0.254: U3.1 14.89,9.05 15.24,9.4 15.24,13.21 14.61,13.84 14.61,15.88 v14.1,16.38 | R2.2 6.95,3.6 v7.62,2.92
  Bottom 0.254: v7.62,2.92 6.35,4.19 6.35,15.24 8.64,17.53 13.08,17.53 14.1,16.51 v14.1,16.38
N$4
  Top 0.254: U3.5 14.79,4.42 R8.1
N$5
  Top 0.254: U$4.1 21.38,5.89 20.95,5.46 20.95,5.21 20.57,4.83 X2.P$1 17.65,6.15 C2.1
N$6  (2 unrouted)
N$7
  Top 0.254: U$4.2 21.88,5.62 21.46,5.21 21.46,4.57 19.94,3.05 17.02,3.05 16.58,3.49 X2.P$2 16.58,6.45 C4.1
N$8  (2 unrouted)
N$9  (2 unrouted)
N$10  (2 unrouted)
N$11  (2 unrouted)
N$12  (2 unrouted)
N$13  (2 unrouted)
N$14  (2 unrouted)
N$15  (2 unrouted)
N$16  (2 unrouted)
N$17  (2 unrouted)
N$18  (2 unrouted)
N$19  (2 unrouted)
N$20  (2 unrouted)
N$21  (2 unrouted)
N$22  (2 unrouted)
N$24  (2 unrouted)
N$25  (2 unrouted)
N$26  (2 unrouted)
N$27  (2 unrouted)
N$28  (2 unrouted)
N$30  (2 unrouted)
N$31  (2 unrouted)
N$32  (2 unrouted)
N$33  (2 unrouted)
N$34  (2 unrouted)
N$35  (2 unrouted)
N$36  (2 unrouted)
N$37  (2 unrouted)
N$38  (2 unrouted)
N$39  (2 unrouted)
N$40  (2 unrouted)
N$41  (2 unrouted)
N$42  (2 unrouted)
N$43  (2 unrouted)
N$44  (2 unrouted)
N$45  (2 unrouted)
N$46  (2 unrouted)
N$47  (2 unrouted)
N$48  (2 unrouted)
SCK
  Top 0.254: U$4.20 27.62,10.41 29.72,10.41 29.9,10.24 29.9,4.78 29.97,4.7 29.97,3.05 JP1.6
SCL  (via drill 0.5)
  Top 0.254: U$4.32 23.38,14.59 22.35,15.62 v22.35,16.13 22.35,16
  Bottom 0.254: JP3.11 41.27,21.59 40.01,20.32 35.56,20.32 35.05,19.81 30.86,19.81 30.35,19.3 28.57,19.3 27.56,18.29 27.56,14.48 26.92,13.84 24.89,13.84 24.89,15.62 24,16.51 22.73,16.51 v22.35,16.13
SDA  (via drill 0.5)
  Top 0.254: U$4.31 23.88,15.36 v23.62,15.62
  Bottom 0.254: JP3.12 43.24,20.38 40.96,20.38 40.39,19.81 35.81,19.81 35.31,19.3 31.11,19.3 30.61,18.8 28.83,18.8 28.07,18.03 28.07,14.22 26.92,13.08 24.64,13.08 24,13.72 24,15.24 v23.62,15.62
SWCLK  (via drill 0.5)
  Top 0.254: U$4.45 19.2,8.4 v19.05,8.26
  Bottom 0.254: v19.05,8.26 18.92,8.13 18.16,8.13 TP1.P$1
SWDIO  (via drill 0.5)
  Top 0.254: U$4.46 19.84,7.9 19.05,7.11 v18.92,7.11
  Bottom 0.254: 19.05,7.11 v18.92,7.11 17.91,6.1 TP2.P$1
VBAT  (via drill 0.5)
  Top 0.254: X1.2 11.81,15.62 | R3.1 20.7,18.12 20.7,17.53 20.45,17.27 v20.07,17.27 | 11.79,12.49 C3.1
  Top 0.406: 11.81,15.62 11.81,18.29 11.92,18.4 v14.46,18.4 15.66,18.4 D1.A 16.51,19.25 JP3.1 | X1.2 11.79,12.49 | C3.1 11.75,12.13 12.7,11.18 12.7,9.65 12.89,9.46 U3.3
  Bottom 0.406: v20.07,17.27 15.59,17.27 v14.46,18.4
VBUS  (via drill 0.5)
  Top 0.254: CHG40.A 1.14,5.59 0.51,6.22 0.51,8.76 1.02,9.27 1.02,12.95 1.27,13.21 3.56,13.21 4.06,12.7 5.19,12.7 X3.VBUS | 7.55,12.01 C6.1 8.16,11.94
  Top 0.406: X3.VBUS 6.83,12.73 7.55,12.01 | JP3.3 19.63,19.63 D1.C 19.11,18.15 U2.1 19.11,16.19 18.67,15.75 16.09,15.75 R1.1 v15.62,13.97 | U3.4 12.89,7.43 12.06,8.26 9.53,8.26 8.76,9.02 8.76,11.33 C6.1 | 8.16,11.94 v9.53,11.94
  Bottom 0.406: v9.53,11.94 10.29,12.7 13.84,12.7 15.11,13.97 v15.62,13.97
VDDCORE
  Top 0.254: U$4.43 19.81,9.4 18.25,10.96 C1.1
~RESET  (via drill 0.5)
  Top 0.254: 6.48,1.27 JP1.16 7.11,1.27 8.89,3.05 8.89,5.33 v9.27,5.71 | U$4.40 20.09,10.9 19.56,11.43 v19.56,11.56 | SW1.1 7.44,5.71 v9.27,5.71 | SW1.3 11.36,5.71 v9.27,5.71
  Bottom 0.254: v9.27,5.71 10.03,6.48 13.72,6.48 14.61,7.37 14.61,9.14 16.51,11.05 19.05,11.05 v19.56,11.56

### Text on the board
tPlace: BAT | En | USB | 13 | 12 | 11 | ~ | 10 | ~ | 9 | ~ | 6 | ~5 | SCL | SDA | #13 | adafruit! | 3.3V | Reset | Feather M0 | basic proto | CHG | GND | SCK | MOSI | MISO | RST | 3V | ARf | GND | A0 | A1 | A2 | A3 | A4 | A5 | RX | 0 | TX | 1 | GND
bPlace: 21 | 20 | 3.7/4.2V / LiPoly Batt / µUSB charge | En | 13 | 12 | 6 | ~ | 5 | SCL | SDA | BAT | USB | 11~ | 10~ | 9~ | Feather M0 Basic | ATSAMD21G18 / 48MHz & 3.3V | swclk | swdio | SCK | 24 | MOSI | 23 | MISO | RST | 3V | ARf | GND | A0 | A1 | A2 | A3 | A4 | A5 | 22 | RX | TX | GND | 0 | 1
BlindViaText: V:GND:3:52 | V:GND:6:52 | FillOverPAD:GND:52:150 | FillOverPAD:GND:125:150 | FillOverPAD:GND:60:150 | V:N$48:52:52 | V:N$40:44:52 | V:N$39:43:52 | V:N$30:34:52 | V:N$28:33:52 | V:N$8:14:52 | V:N$11:17:52 | V:N$12:18:52 | V:GND:12:52 | FillOverPAD:GND:134:150 | FillOverPAD:GND:10:150 | FillOverPAD:GND:12:150 | V:N$46:50:52 | V:N$41:45:52 | V:N$38:42:52 | V:N$31:35:52 | V:N$27:32:52 | V:N$9:15:52 | V:N$10:16:52 | V:N$13:19:52 | FillOverPAD:GND:14:150 | FillOverPAD:GND:2:150 | FillOverPAD:GND:105:150 | V:GND:1:52 | FillOverPAD:GND:140:150 | V:GND:8:52 | V:GND:10:52 | V:N$47:51:52 | V:N$42:46:52 | V:N$37:41:52 | V:N$32:36:52 | V:N$26:31:52 | V:N$18:24:52 | V:N$17:23:52 | V:N$14:20:52 | FillOverPAD:GND:141:150 | V:GND:2:52 | FillOverPAD:GND:16:150 | FillOverPAD:GND:144:150 | FillOverPAD:GND:6:150 | FillOverPAD:GND:112:150 | V:GND:7:52 | FillOverPAD:GND:119:150 | V:GND:9:52 | FillOverPAD:GND:130:150 | FillOverPAD:GND:88:150 | V:N$6:13:52 | V:N$43:47:52 | V:N$36:40:52 | V:N$33:37:52 | V:N$25:30:52 | V:N$19:25:52 | V:N$16:22:52 | V:N$15:21:52 | FillOverPAD:GND:8:150 | FillOverPAD:GND:4:150 | FillOverPAD:GND:66:150 | V:GND:5:52 | FillOverPAD:GND:68:150 | V:GND:4:52 | FillOverPAD:GND:75:150 | V:N$22:28:52 | V:N$44:48:52 | V:N$35:39:52 | V:N$34:38:52 | V:N$24:29:52 | V:N$20:26:52 | V:N$21:27:52 | V:N$45:49:52 | FillOverPAD:GND:18:150 | FillOverPAD:GND:64:150 | V:GND:11:52